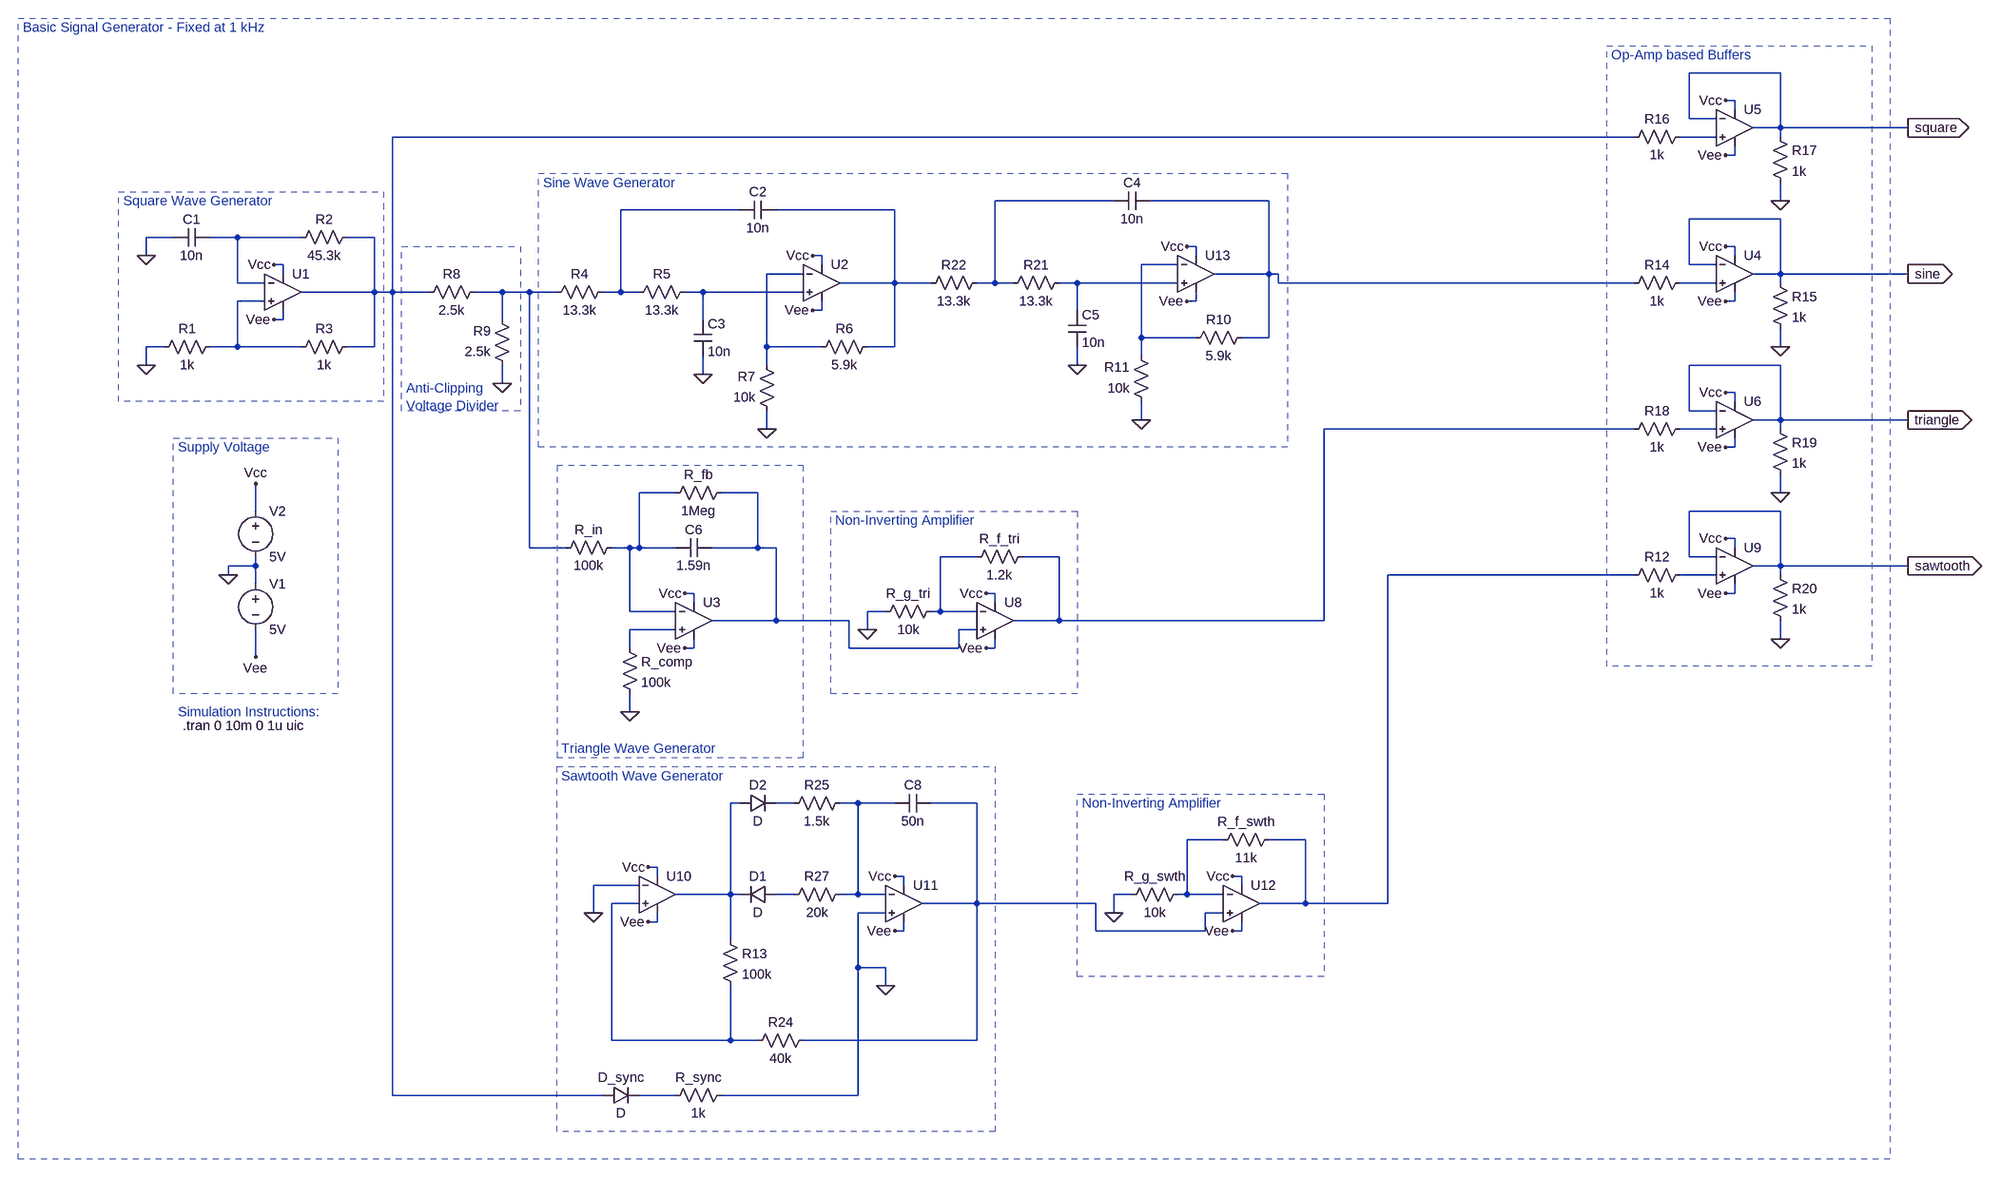
[diagram p0: schematic multi-wave-osc-2.asc]
multi-wave-osc-2.asc, the LTspice schematic file:
Version 4
SHEET 1 3220 2516
WIRE 2800 -192 2640 -192
WIRE 2720 -144 2704 -144
WIRE 2720 -128 2720 -144
WIRE 2640 -112 2640 -192
WIRE 2688 -112 2640 -112
WIRE 2800 -96 2800 -192
WIRE 2800 -96 2752 -96
WIRE 3024 -96 2800 -96
WIRE 2544 -80 368 -80
WIRE 2688 -80 2624 -80
WIRE 2800 -80 2800 -96
WIRE 2720 -48 2720 -64
WIRE 2720 -48 2704 -48
WIRE 1632 32 1424 32
WIRE 1904 32 1696 32
WIRE 2800 32 2800 0
WIRE 976 48 768 48
WIRE 1248 48 1040 48
WIRE 2800 64 2640 64
WIRE -16 96 -64 96
WIRE 96 96 48 96
WIRE 208 96 96 96
WIRE 336 96 288 96
WIRE 1776 112 1760 112
WIRE 2720 112 2704 112
WIRE -64 128 -64 96
WIRE 1120 128 1104 128
WIRE 1776 128 1776 112
WIRE 2720 128 2720 112
WIRE 176 144 160 144
WIRE 1120 144 1120 128
WIRE 1744 144 1680 144
WIRE 2640 144 2640 64
WIRE 2688 144 2640 144
WIRE 176 160 176 144
WIRE 1088 160 1024 160
WIRE 1904 160 1904 32
WIRE 1904 160 1808 160
WIRE 1920 160 1904 160
WIRE 2800 160 2800 64
WIRE 2800 160 2752 160
WIRE 3024 160 2800 160
WIRE 96 176 96 96
WIRE 144 176 96 176
WIRE 1248 176 1248 48
WIRE 1248 176 1152 176
WIRE 1312 176 1248 176
WIRE 1424 176 1424 32
WIRE 1424 176 1392 176
WIRE 1456 176 1424 176
WIRE 1568 176 1536 176
WIRE 1744 176 1568 176
WIRE 1920 176 1920 160
WIRE 2544 176 1920 176
WIRE 2688 176 2624 176
WIRE 2800 176 2800 160
WIRE 336 192 336 96
WIRE 336 192 208 192
WIRE 368 192 368 -80
WIRE 368 192 336 192
WIRE 432 192 368 192
WIRE 560 192 512 192
WIRE 608 192 560 192
WIRE 656 192 608 192
WIRE 768 192 768 48
WIRE 768 192 736 192
WIRE 800 192 768 192
WIRE 912 192 880 192
WIRE 1088 192 912 192
WIRE 144 208 96 208
WIRE 1776 208 1776 192
WIRE 1776 208 1760 208
WIRE 2720 208 2720 192
WIRE 2720 208 2704 208
WIRE 1120 224 1120 208
WIRE 1120 224 1104 224
WIRE 1568 224 1568 176
WIRE 176 240 176 224
WIRE 176 240 160 240
WIRE 560 240 560 192
WIRE 912 240 912 192
WIRE 1680 272 1680 144
WIRE 1776 272 1680 272
WIRE 1904 272 1904 160
WIRE 1904 272 1856 272
WIRE -32 288 -64 288
WIRE 96 288 96 208
WIRE 96 288 48 288
WIRE 208 288 96 288
WIRE 336 288 336 192
WIRE 336 288 288 288
WIRE 1024 288 1024 160
WIRE 1120 288 1024 288
WIRE 1248 288 1248 176
WIRE 1248 288 1200 288
WIRE 2800 288 2800 256
WIRE 1680 304 1680 272
WIRE -64 320 -64 288
WIRE 1024 320 1024 288
WIRE 1568 320 1568 288
WIRE 2800 320 2640 320
WIRE 912 336 912 304
WIRE 560 352 560 320
WIRE 2720 368 2704 368
WIRE 2720 384 2720 368
WIRE 2640 400 2640 320
WIRE 2688 400 2640 400
WIRE 1680 416 1680 384
WIRE 2800 416 2800 320
WIRE 2800 416 2752 416
WIRE 3024 416 2800 416
WIRE 1024 432 1024 400
WIRE 2544 432 2000 432
WIRE 2688 432 2624 432
WIRE 2800 432 2800 416
WIRE 2720 464 2720 448
WIRE 2720 464 2704 464
WIRE 864 544 800 544
WIRE 1008 544 944 544
WIRE 2800 544 2800 512
WIRE 128 576 128 528
WIRE 2800 576 2640 576
WIRE 2720 624 2704 624
WIRE 608 640 608 192
WIRE 672 640 608 640
WIRE 784 640 752 640
WIRE 800 640 800 544
WIRE 800 640 784 640
WIRE 864 640 800 640
WIRE 1008 640 1008 544
WIRE 1008 640 928 640
WIRE 1040 640 1008 640
WIRE 2720 640 2720 624
WIRE 1392 656 1328 656
WIRE 1536 656 1472 656
WIRE 2640 656 2640 576
WIRE 2688 656 2640 656
WIRE 128 672 128 656
WIRE 128 672 80 672
WIRE 2800 672 2800 576
WIRE 2800 672 2752 672
WIRE 3024 672 2800 672
WIRE 80 688 80 672
WIRE 2544 688 2112 688
WIRE 2688 688 2624 688
WIRE 2800 688 2800 672
WIRE 128 704 128 672
WIRE 896 720 880 720
WIRE 1424 720 1408 720
WIRE 2720 720 2720 704
WIRE 2720 720 2704 720
WIRE 896 736 896 720
WIRE 1424 736 1424 720
WIRE 784 752 784 640
WIRE 864 752 784 752
WIRE 1232 752 1200 752
WIRE 1328 752 1328 656
WIRE 1328 752 1312 752
WIRE 1392 752 1328 752
WIRE 1040 768 1040 640
WIRE 1040 768 928 768
WIRE 1168 768 1040 768
WIRE 1536 768 1536 656
WIRE 1536 768 1456 768
WIRE 2000 768 2000 432
WIRE 2000 768 1536 768
WIRE 864 784 784 784
WIRE 1200 784 1200 752
WIRE 1392 784 1360 784
WIRE 2800 800 2800 768
WIRE 784 816 784 784
WIRE 896 816 896 800
WIRE 896 816 880 816
WIRE 1168 816 1168 768
WIRE 1360 816 1360 784
WIRE 1360 816 1168 816
WIRE 1424 816 1424 800
WIRE 1424 816 1408 816
WIRE 128 832 128 784
WIRE 784 928 784 896
WIRE 976 1088 960 1088
WIRE 1072 1088 1040 1088
WIRE 1184 1088 1152 1088
WIRE 1248 1088 1184 1088
WIRE 1392 1088 1312 1088
WIRE 1824 1152 1760 1152
WIRE 1968 1152 1904 1152
WIRE 832 1200 816 1200
WIRE 832 1216 832 1200
WIRE 1264 1216 1248 1216
WIRE 1856 1216 1840 1216
WIRE 800 1232 720 1232
WIRE 1264 1232 1264 1216
WIRE 1856 1232 1856 1216
WIRE 960 1248 960 1088
WIRE 960 1248 864 1248
WIRE 976 1248 960 1248
WIRE 1072 1248 1040 1248
WIRE 1184 1248 1184 1088
WIRE 1184 1248 1152 1248
WIRE 1232 1248 1184 1248
WIRE 1664 1248 1632 1248
WIRE 1760 1248 1760 1152
WIRE 1760 1248 1744 1248
WIRE 1824 1248 1760 1248
WIRE 800 1264 752 1264
WIRE 1392 1264 1392 1088
WIRE 1392 1264 1296 1264
WIRE 1600 1264 1392 1264
WIRE 1968 1264 1968 1152
WIRE 1968 1264 1888 1264
WIRE 2112 1264 2112 688
WIRE 2112 1264 1968 1264
WIRE 720 1280 720 1232
WIRE 1232 1280 1184 1280
WIRE 1632 1280 1632 1248
WIRE 1824 1280 1792 1280
WIRE 832 1296 832 1280
WIRE 832 1296 816 1296
WIRE 1264 1312 1264 1296
WIRE 1264 1312 1248 1312
WIRE 1600 1312 1600 1264
WIRE 1792 1312 1792 1280
WIRE 1792 1312 1600 1312
WIRE 1856 1312 1856 1296
WIRE 1856 1312 1840 1312
WIRE 960 1328 960 1248
WIRE 1184 1376 1184 1280
WIRE 1232 1376 1184 1376
WIRE 1232 1408 1232 1376
WIRE 752 1504 752 1264
WIRE 960 1504 960 1408
WIRE 960 1504 752 1504
WIRE 1008 1504 960 1504
WIRE 1392 1504 1392 1264
WIRE 1392 1504 1088 1504
WIRE 368 1600 368 192
WIRE 736 1600 368 1600
WIRE 864 1600 800 1600
WIRE 1184 1600 1184 1376
WIRE 1184 1600 944 1600
FLAG -64 128 0
FLAG -64 320 0
FLAG 80 688 0
FLAG 3024 -96 square
IOPIN 3024 -96 Out
FLAG 128 528 Vcc
FLAG 128 832 Vee
FLAG 160 144 Vcc
FLAG 160 240 Vee
FLAG 1104 128 Vcc
FLAG 1104 224 Vee
FLAG 1024 432 0
FLAG 912 336 0
FLAG 3024 160 sine
IOPIN 3024 160 Out
FLAG 560 352 0
FLAG 3024 416 triangle
IOPIN 3024 416 Out
FLAG 880 720 Vcc
FLAG 880 816 Vee
FLAG 2704 112 Vcc
FLAG 2704 208 Vee
FLAG 2800 288 0
FLAG 2704 -144 Vcc
FLAG 2704 -48 Vee
FLAG 2800 32 0
FLAG 2704 368 Vcc
FLAG 2704 464 Vee
FLAG 2800 544 0
FLAG 784 928 0
FLAG 1408 720 Vcc
FLAG 1408 816 Vee
FLAG 1200 784 0
FLAG 816 1200 Vcc
FLAG 816 1296 Vee
FLAG 1248 1216 Vcc
FLAG 1248 1312 Vee
FLAG 2704 624 Vcc
FLAG 2704 720 Vee
FLAG 2800 800 0
FLAG 3024 672 sawtooth
IOPIN 3024 672 Out
FLAG 1840 1216 Vcc
FLAG 1840 1312 Vee
FLAG 1632 1280 0
FLAG 720 1280 0
FLAG 1232 1408 0
FLAG 1760 112 Vcc
FLAG 1760 208 Vee
FLAG 1680 416 0
FLAG 1568 320 0
SYMBOL OpAmps\\UniversalOpamp2 176 192 R0
SYMATTR InstName U1
SYMBOL cap 48 80 R90
WINDOW 0 0 32 VBottom 2
WINDOW 3 32 32 VTop 2
SYMATTR InstName C1
SYMATTR Value 10n
SYMBOL res 64 272 R90
WINDOW 0 0 56 VBottom 2
WINDOW 3 32 56 VTop 2
SYMATTR InstName R1
SYMATTR Value 1k
SYMBOL res 304 80 R90
WINDOW 0 0 56 VBottom 2
WINDOW 3 32 56 VTop 2
SYMATTR InstName R2
SYMATTR Value 45.3k
SYMBOL res 304 272 R90
WINDOW 0 0 56 VBottom 2
WINDOW 3 32 56 VTop 2
SYMATTR InstName R3
SYMATTR Value 1k
SYMBOL voltage 128 688 R0
WINDOW 123 0 0 Left 0
WINDOW 39 0 0 Left 0
SYMATTR InstName V1
SYMATTR Value 5V
SYMBOL voltage 128 560 R0
WINDOW 123 0 0 Left 0
WINDOW 39 0 0 Left 0
SYMATTR InstName V2
SYMATTR Value 5V
SYMBOL OpAmps\\UniversalOpamp2 1120 176 R0
SYMATTR InstName U2
SYMBOL res 1216 272 R90
WINDOW 0 0 56 VBottom 2
WINDOW 3 32 56 VTop 2
SYMATTR InstName R6
SYMATTR Value 5.9k
SYMBOL res 1040 416 R180
WINDOW 0 36 76 Left 2
WINDOW 3 36 40 Left 2
SYMATTR InstName R7
SYMATTR Value 10k
SYMBOL cap 1040 32 R90
WINDOW 0 0 32 VBottom 2
WINDOW 3 32 32 VTop 2
SYMATTR InstName C2
SYMATTR Value 10n
SYMBOL cap 896 240 R0
SYMATTR InstName C3
SYMATTR Value 10n
SYMBOL res 896 176 R90
WINDOW 0 0 56 VBottom 2
WINDOW 3 32 56 VTop 2
SYMATTR InstName R5
SYMATTR Value 13.3k
SYMBOL res 752 176 R90
WINDOW 0 0 56 VBottom 2
WINDOW 3 32 56 VTop 2
SYMATTR InstName R4
SYMATTR Value 13.3k
SYMBOL res 528 176 R90
WINDOW 0 0 56 VBottom 2
WINDOW 3 32 56 VTop 2
SYMATTR InstName R8
SYMATTR Value 2.5k
SYMBOL res 576 336 R180
WINDOW 0 36 76 Left 2
WINDOW 3 36 40 Left 2
SYMATTR InstName R9
SYMATTR Value 2.5k
SYMBOL res 768 624 R90
WINDOW 0 0 56 VBottom 2
WINDOW 3 32 56 VTop 2
SYMATTR InstName R_in
SYMATTR Value 100k
SYMBOL cap 928 624 R90
WINDOW 0 0 32 VBottom 2
WINDOW 3 32 32 VTop 2
SYMATTR InstName C6
SYMATTR Value 1.59n
SYMBOL res 960 528 R90
WINDOW 0 0 56 VBottom 2
WINDOW 3 32 56 VTop 2
SYMATTR InstName R_fb
SYMATTR Value 1Meg
SYMBOL OpAmps\\UniversalOpamp2 896 768 R0
SYMATTR InstName U3
SYMBOL OpAmps\\UniversalOpamp2 2720 160 R0
SYMATTR InstName U4
SYMBOL res 2640 160 R90
WINDOW 0 0 56 VBottom 2
WINDOW 3 32 56 VTop 2
SYMATTR InstName R14
SYMATTR Value 1k
SYMBOL res 2784 160 R0
SYMATTR InstName R15
SYMATTR Value 1k
SYMBOL OpAmps\\UniversalOpamp2 2720 -96 R0
SYMATTR InstName U5
SYMBOL res 2640 -96 R90
WINDOW 0 0 56 VBottom 2
WINDOW 3 32 56 VTop 2
SYMATTR InstName R16
SYMATTR Value 1k
SYMBOL res 2784 -96 R0
SYMATTR InstName R17
SYMATTR Value 1k
SYMBOL OpAmps\\UniversalOpamp2 2720 416 R0
SYMATTR InstName U6
SYMBOL res 2640 416 R90
WINDOW 0 0 56 VBottom 2
WINDOW 3 32 56 VTop 2
SYMATTR InstName R18
SYMATTR Value 1k
SYMBOL res 2784 416 R0
SYMATTR InstName R19
SYMATTR Value 1k
SYMBOL res 768 800 R0
SYMATTR InstName R_comp
SYMATTR Value 100k
SYMBOL OpAmps\\UniversalOpamp2 1424 768 R0
SYMATTR InstName U8
SYMBOL res 1488 640 R90
WINDOW 0 0 56 VBottom 2
WINDOW 3 32 56 VTop 2
SYMATTR InstName R_f_tri
SYMATTR Value 1.2k
SYMBOL res 1328 736 R90
WINDOW 0 0 56 VBottom 2
WINDOW 3 32 56 VTop 2
SYMATTR InstName R_g_tri
SYMATTR Value 10k
SYMBOL OpAmps\\UniversalOpamp2 832 1248 R0
SYMATTR InstName U10
SYMBOL OpAmps\\UniversalOpamp2 1264 1264 R0
SYMATTR InstName U11
SYMBOL diode 1040 1232 R90
WINDOW 0 0 32 VBottom 2
WINDOW 3 32 32 VTop 2
SYMATTR InstName D1
SYMBOL diode 976 1104 R270
WINDOW 0 32 32 VTop 2
WINDOW 3 0 32 VBottom 2
SYMATTR InstName D2
SYMBOL res 1168 1072 R90
WINDOW 0 0 56 VBottom 2
WINDOW 3 32 56 VTop 2
SYMATTR InstName R25
SYMATTR Value 1.5k
SYMBOL res 1168 1232 R90
WINDOW 0 0 56 VBottom 2
WINDOW 3 32 56 VTop 2
SYMATTR InstName R27
SYMATTR Value 20k
SYMBOL cap 1312 1072 R90
WINDOW 0 0 32 VBottom 2
WINDOW 3 32 32 VTop 2
SYMATTR InstName C8
SYMATTR Value 50n
SYMBOL res 944 1312 R0
SYMATTR InstName R13
SYMATTR Value 100k
SYMBOL res 1104 1488 R90
WINDOW 0 0 56 VBottom 2
WINDOW 3 32 56 VTop 2
SYMATTR InstName R24
SYMATTR Value 40k
SYMBOL OpAmps\\UniversalOpamp2 2720 672 R0
SYMATTR InstName U9
SYMBOL res 2640 672 R90
WINDOW 0 0 56 VBottom 2
WINDOW 3 32 56 VTop 2
SYMATTR InstName R12
SYMATTR Value 1k
SYMBOL res 2784 672 R0
SYMATTR InstName R20
SYMATTR Value 1k
SYMBOL OpAmps\\UniversalOpamp2 1856 1264 R0
SYMATTR InstName U12
SYMBOL res 1920 1136 R90
WINDOW 0 0 56 VBottom 2
WINDOW 3 32 56 VTop 2
SYMATTR InstName R_f_swth
SYMATTR Value 11k
SYMBOL res 1760 1232 R90
WINDOW 0 0 56 VBottom 2
WINDOW 3 32 56 VTop 2
SYMATTR InstName R_g_swth
SYMATTR Value 10k
SYMBOL res 960 1584 R90
WINDOW 0 0 56 VBottom 2
WINDOW 3 32 56 VTop 2
SYMATTR InstName R_sync
SYMATTR Value 1k
SYMBOL diode 736 1616 R270
WINDOW 0 32 32 VTop 2
WINDOW 3 0 32 VBottom 2
SYMATTR InstName D_sync
SYMBOL OpAmps\\UniversalOpamp2 1776 160 R0
SYMATTR InstName U13
SYMBOL res 1872 256 R90
WINDOW 0 0 56 VBottom 2
WINDOW 3 32 56 VTop 2
SYMATTR InstName R10
SYMATTR Value 5.9k
SYMBOL res 1696 400 R180
WINDOW 0 36 76 Left 2
WINDOW 3 36 40 Left 2
SYMATTR InstName R11
SYMATTR Value 10k
SYMBOL cap 1696 16 R90
WINDOW 0 0 32 VBottom 2
WINDOW 3 32 32 VTop 2
SYMATTR InstName C4
SYMATTR Value 10n
SYMBOL cap 1552 224 R0
SYMATTR InstName C5
SYMATTR Value 10n
SYMBOL res 1552 160 R90
WINDOW 0 0 56 VBottom 2
WINDOW 3 32 56 VTop 2
SYMATTR InstName R21
SYMATTR Value 13.3k
SYMBOL res 1408 160 R90
WINDOW 0 0 56 VBottom 2
WINDOW 3 32 56 VTop 2
SYMATTR InstName R22
SYMATTR Value 13.3k
TEXT 0 952 Left 2 !.tran 0 10m 0 1u uic
TEXT -104 32 Left 2 ;Square Wave Generator
TEXT 632 0 Left 2 ;Sine Wave Generator
TEXT 664 992 Left 2 ;Triangle Wave Generator
TEXT 2504 -224 Left 2 ;Op-Amp based Buffers
TEXT 392 360 Left 2 ;Anti-Clipping \nVoltage Divider
TEXT 1144 592 Left 2 ;Non-Inverting Amplifier
TEXT 1576 1088 Left 2 ;Non-Inverting Amplifier
TEXT 664 1040 Left 2 ;Sawtooth Wave Generator
TEXT -280 -272 Left 2 ;Basic Signal Generator - Fixed at 1 kHz
TEXT -8 464 Left 2 ;Supply Voltage
TEXT -8 928 Left 2 ;Simulation Instructions:
RECTANGLE Normal 352 384 -112 16 2
RECTANGLE Normal 656 1008 1088 496 2
RECTANGLE Normal 1568 896 1136 576 2
RECTANGLE Normal 2960 848 2496 -240 2
RECTANGLE Normal 2000 1392 1568 1072 2
RECTANGLE Normal 272 896 -16 448 2
RECTANGLE Normal 592 400 384 112 2
RECTANGLE Normal 1424 1664 656 1024 2
RECTANGLE Normal 1936 464 624 -16 2
RECTANGLE Normal 2992 1712 -288 -288 2

The netlist it stands for:
* multi-wave-osc-2.asc
XU1 N014 N007 Vcc Vee N001 level.2 Avol=1Meg GBW=10Meg Slew=10Meg ilimit=25m rail=0 Vos=0 phimargin=45 en=0 enk=0 in=0 ink=0 Rin=500Meg  ; pins IN+ IN- V+ V- OUT
C1 N007 0 10n
R1 N014 0 1k
R2 N001 N007 45.3k
R3 N001 N014 1k
V1 0 Vee 5V
V2 Vcc 0 5V
XU2 N013 N009 Vcc Vee N006 level.2 Avol=1Meg GBW=10Meg Slew=10Meg ilimit=25m rail=0 Vos=0 phimargin=45 en=0 enk=0 in=0 ink=0 Rin=500Meg  ; pins IN+ IN- V+ V- OUT
R6 N006 N009 5.9k
R7 0 N009 10k
C2 N006 N005 10n
C3 N013 0 10n
R5 N013 N005 13.3k
R4 N005 N012 13.3k
R8 N012 N001 2.5k
R9 0 N012 2.5k
R_in N017 N012 100k
C6 N018 N017 1.59n
R_fb N018 N017 1Meg
XU3 N022 N017 Vcc Vee N018 level.2 Avol=1Meg GBW=10Meg Slew=10Meg ilimit=25m rail=0 Vos=0 phimargin=45 en=0 enk=0 in=0 ink=0 Rin=500Meg  ; pins IN+ IN- V+ V- OUT
XU4 N011 sine Vcc Vee sine level.2 Avol=1Meg GBW=10Meg Slew=10Meg ilimit=25m rail=0 Vos=0 phimargin=45 en=0 enk=0 in=0 ink=0 Rin=500Meg  ; pins IN+ IN- V+ V- OUT
R14 N011 N004 1k
R15 sine 0 1k
XU5 N002 square Vcc Vee square level.2 Avol=1Meg GBW=10Meg Slew=10Meg ilimit=25m rail=0 Vos=0 phimargin=45 en=0 enk=0 in=0 ink=0 Rin=500Meg  ; pins IN+ IN- V+ V- OUT
R16 N002 N001 1k
R17 square 0 1k
XU6 N016 triangle Vcc Vee triangle level.2 Avol=1Meg GBW=10Meg Slew=10Meg ilimit=25m rail=0 Vos=0 phimargin=45 en=0 enk=0 in=0 ink=0 Rin=500Meg  ; pins IN+ IN- V+ V- OUT
R18 N016 N015 1k
R19 triangle 0 1k
R_comp N022 0 100k
XU8 N018 N019 Vcc Vee N015 level.2 Avol=1Meg GBW=10Meg Slew=10Meg ilimit=25m rail=0 Vos=0 phimargin=45 en=0 enk=0 in=0 ink=0 Rin=500Meg  ; pins IN+ IN- V+ V- OUT
R_f_tri N015 N019 1.2k
R_g_tri N019 0 10k
XU10 N029 0 Vcc Vee N023 level.2 Avol=1Meg GBW=10Meg Slew=10Meg ilimit=25m rail=0 Vos=0 phimargin=45 en=0 enk=0 in=0 ink=0 Rin=500Meg  ; pins IN+ IN- V+ V- OUT
XU11 0 N025 Vcc Vee N026 level.2 Avol=1Meg GBW=10Meg Slew=10Meg ilimit=25m rail=0 Vos=0 phimargin=45 en=0 enk=0 in=0 ink=0 Rin=500Meg  ; pins IN+ IN- V+ V- OUT
D1 N028 N023 D
D2 N023 N024 D
R25 N025 N024 1.5k
R27 N025 N028 20k
C8 N026 N025 50n
R13 N023 N029 100k
R24 N026 N029 40k
XU9 N021 sawtooth Vcc Vee sawtooth level.2 Avol=1Meg GBW=10Meg Slew=10Meg ilimit=25m rail=0 Vos=0 phimargin=45 en=0 enk=0 in=0 ink=0 Rin=500Meg  ; pins IN+ IN- V+ V- OUT
R12 N021 N020 1k
R20 sawtooth 0 1k
XU12 N026 N027 Vcc Vee N020 level.2 Avol=1Meg GBW=10Meg Slew=10Meg ilimit=25m rail=0 Vos=0 phimargin=45 en=0 enk=0 in=0 ink=0 Rin=500Meg  ; pins IN+ IN- V+ V- OUT
R_f_swth N020 N027 11k
R_g_swth N027 0 10k
R_sync 0 N030 1k
D_sync N001 N030 D
XU13 N010 N008 Vcc Vee N004 level.2 Avol=1Meg GBW=10Meg Slew=10Meg ilimit=25m rail=0 Vos=0 phimargin=45 en=0 enk=0 in=0 ink=0 Rin=500Meg  ; pins IN+ IN- V+ V- OUT
R10 N004 N008 5.9k
R11 0 N008 10k
C4 N004 N003 10n
C5 N010 0 10n
R21 N010 N003 13.3k
R22 N003 N006 13.3k
.model D D
.lib standard.dio
.tran 0 10m 0 1u uic
* Square Wave Generator
* Sine Wave Generator
* Triangle Wave Generator
* Op-Amp based Buffers
* Anti-Clipping
* Voltage Divider
* Non-Inverting Amplifier
* Non-Inverting Amplifier
* Sawtooth Wave Generator
* Basic Signal Generator - Fixed at 1 kHz
* Supply Voltage
* Simulation Instructions:
.lib UniversalOpamps2.sub
.backanno
.end